# Altium schematic sheet BCD8.schdoc
size A4; Organization: Altium Limited; Address1: L3, 12a Rodborough Rd; Address2: Frenchs Forest; Address3: NSW; Address4: Australia 2086; DocumentNumber: 1; SheetNumber: 1; SheetTotal: 1
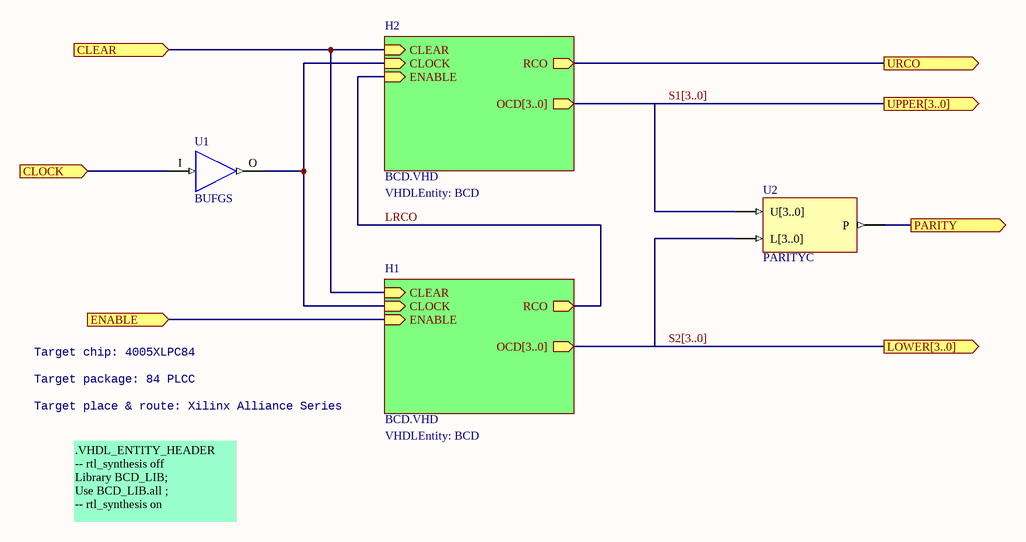
[diagram p0: BCD8.schdoc]

## Parts
U1  BUFGS
U2  PARITYC  [None Available]

## Sub-sheets
H1 = BCD.VHD: CLEAR (in), CLOCK (in), ENABLE (in), RCO (out), OCD[3..0] (out)  | Description: H1; VHDLEntity: BCD
H2 = BCD.VHD: CLEAR (in), CLOCK (in), ENABLE (in), RCO (out), OCD[3..0] (out)  | Description: H2; VHDLEntity: BCD

## Ports
CLEAR (in), CLOCK (in), ENABLE (in), LOWER[3..0] (out), PARITY (out), UPPER[3..0] (out), URCO (out)

## Nets
CLEAR: port CLEAR, sheet H2/CLEAR, sheet H1/CLEAR
CLOCK: U1.I ; port CLOCK
ENABLE: port ENABLE, sheet H1/ENABLE
LRCO: sheet H2/ENABLE, sheet H1/RCO
PARITY: U2.P ; port PARITY
S1[3..0]: U2.U[3..0] ; port UPPER[3..0], sheet H2/OCD[3..0]
S2[3..0]: U2.L[3..0] ; port LOWER[3..0], sheet H1/OCD[3..0]
URCO: port URCO, sheet H2/RCO
NetU1_O: U1.O ; sheet H2/CLOCK, sheet H1/CLOCK

## Buses and harness runs
bus S1[3..0] = port UPPER[3..0] = sheet H2/OCD[3..0]
bus S2[3..0] = port LOWER[3..0] = sheet H1/OCD[3..0]

## Notes on the sheet
- Target chip: 4005XLPC84
- Target package: 84 PLCC
- Target place & route: Xilinx Alliance Series
- .VHDL_ENTITY_HEADER
  -- rtl_synthesis off
  Library BCD_LIB;
  Use BCD_LIB.all ;
  -- rtl_synthesis on
- Title
- Size:
- Date:
- A4
- Number:
- Time:
- Revision:
- Sheet
- of
- File: